# EAGLE design wifi-usb-breakout (EAGLE 7.7.0)
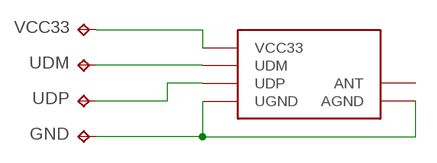
[diagram p0: schematic, sheet 1]

## Parts
GND  TPTP09R  [TP09R]
U$1  USB-WIFI-MODULE  [USB-WIFI-MODULE]
UDM  TPTP09R  [TP09R]
UDP  TPTP09R  [TP09R]
VCC33  TPTP09R  [TP09R]

## Nets
N$1: U$1.P$1(VCC33) VCC33.TP
N$2: U$1.P$2(UDM) UDM.TP
N$3: U$1.P$3(UDP) UDP.TP
N$4: GND.TP U$1.P$4(UGND) U$1.P$5(AGND)
Unconnected: U$1.P$6(ANT)

## Library data of the parts
GND UDM UDP VCC33 = testpad:TP: Test pad
U$1 = usb-wifi-module:USB-WIFI-MODULE

## Board
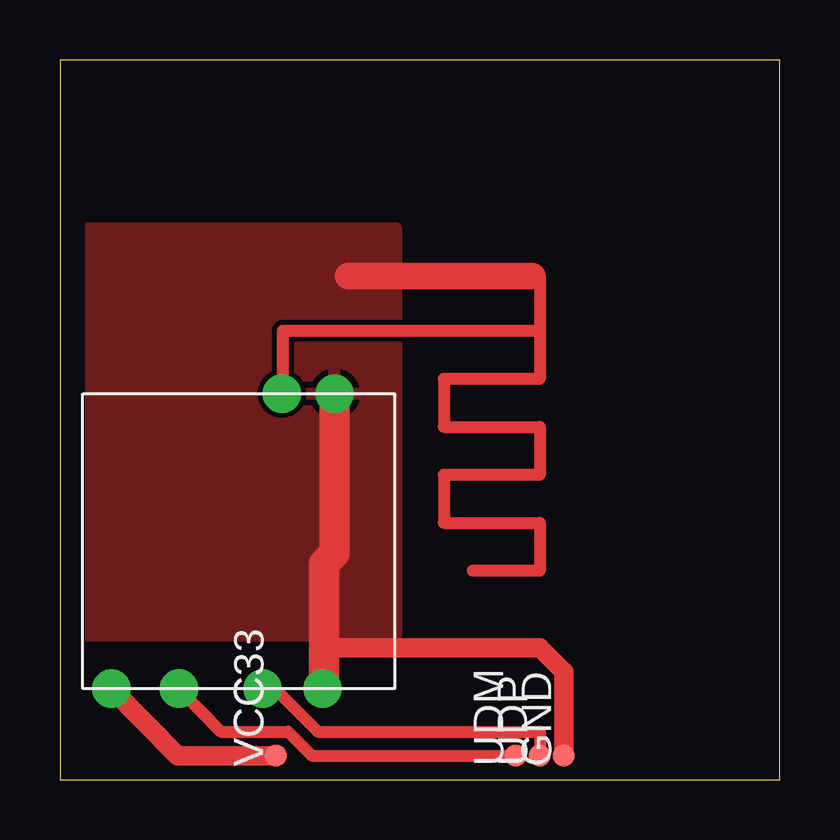
[diagram p1: board, top side]

Size 30 x 30 mm. Coordinates in mm from the lower left corner, seen from the top.
Outline: 0,0 30,0 30,30 0,30 0,0
Copper layers (1*16): Top 0.035mm / dielectric 1.5mm / Bottom 0.035mm
Design rules "default *": minimum track width 10mil, minimum drill 24mil, track to track 8mil, track to pad 8mil, pad to pad 8mil, via to via 8mil, smd to smd 8mil, copper to edge 40mil, drill to drill 8mil, minimum pad ring 10mil, minimum via ring 8mil, stop-mask expansion 4mil, vias tented up to drill 0mil, thermal gap 10mil

### Footprints (pad centres in the part's own frame; a part is rotated, then mirrored left to right if it is on the bottom)
TP09R = smd 0.9 x 0.9: TP 0,0
USB-WIFI-MODULE = drill 0.1 pad 1.6: P$1 -6.15,5.3; P$2 -6.15,2.5; P$3 -6.15,-1; P$4 -6.15,-3.5; P$5 6.15,-4; P$6 6.15,-1.8

### Placement (x,y rotation side)
GND  21,1 90 top
U$1  7.45,9.94 90 top
UDM  19,1 90 top
UDP  20,1 90 top
VCC33  9,1 90 top

### Tracks (layer width: path | path; a pad name or v marks a point on that pad's centre or on a via)
N$1
  Top 0.813: U$1.P$1 4.9,1 VCC33.TP
N$2
  Top 0.5: U$1.P$2 6.7,2 9.5,2 10.5,1 UDM.TP
N$3
  Top 0.5: U$1.P$3 8.96,3.79 10.75,2 20,2 UDP.TP
N$4
  Top 0.5: 11,3.84 11,3.5
  Top 0.813: 11,3.5 11,5.5 20,5.5 21,4.5 GND.TP
  Top 1.1: 12,21 19.7,21
  Top 1.27: U$1.P$5 11.45,9.45 11,9 11,5.5 11,3.84 U$1.P$4
  pour Top: 1,23 14,23 14,6 1,6
N$5
  Top 0.5: 20,21 20,18.7 | 20,18.7 20,16.7 16,16.7 16,14.7 20,14.7 20,12.7 16,12.7 16,10.7 20,10.7 20,8.7 17.2,8.7 | 20,18.7 9.3,18.7
N$7
  Top 0.5: 9.3,16 9.3,18.7